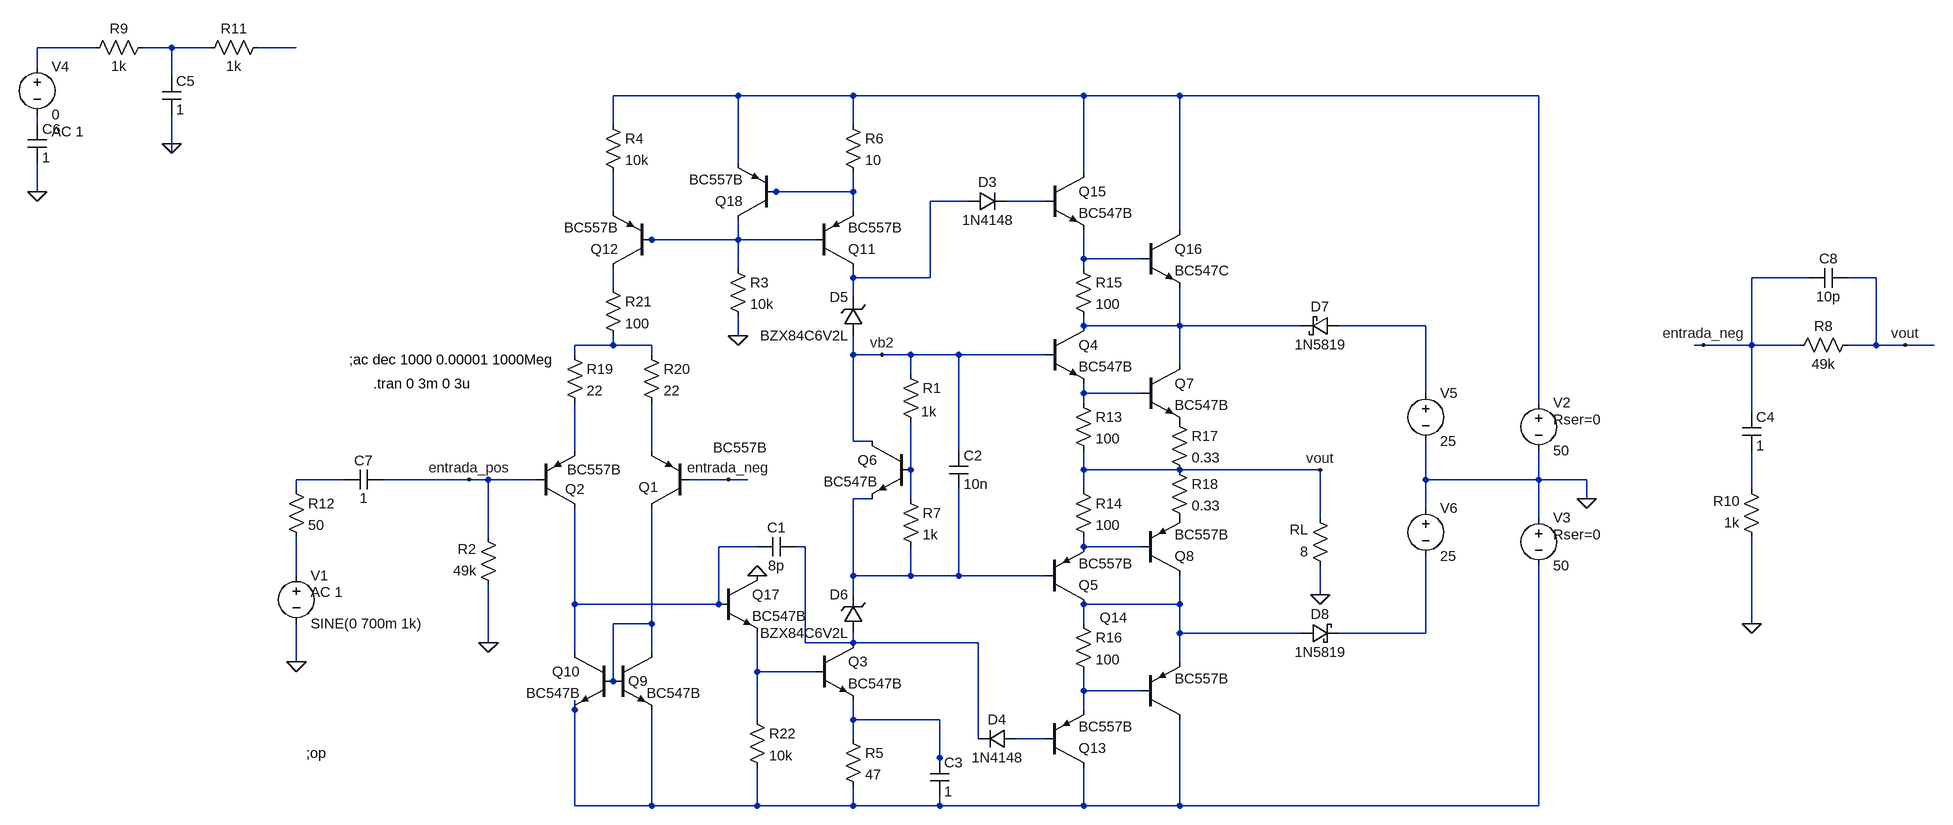
[diagram p0: schematic amplificador clase G.asc]
amplificador clase G.asc, the LTspice schematic file:
Version 4
SHEET 1 1332 756
WIRE -2064 -928 -2160 -928
WIRE -1936 -928 -1984 -928
WIRE -1872 -928 -1936 -928
WIRE -1728 -928 -1792 -928
WIRE -2160 -896 -2160 -928
WIRE -1936 -880 -1936 -928
WIRE -992 -848 -1200 -848
WIRE -800 -848 -992 -848
WIRE -416 -848 -800 -848
WIRE -256 -848 -416 -848
WIRE 496 -848 -256 -848
WIRE -2160 -800 -2160 -816
WIRE -1200 -800 -1200 -848
WIRE -800 -800 -800 -848
WIRE -1936 -768 -1936 -816
WIRE -1936 -752 -1936 -768
WIRE -992 -736 -992 -848
WIRE -416 -720 -416 -848
WIRE -2160 -688 -2160 -736
WIRE -928 -688 -944 -688
WIRE -800 -688 -800 -720
WIRE -800 -688 -928 -688
WIRE -608 -672 -672 -672
WIRE -480 -672 -544 -672
WIRE -1200 -656 -1200 -720
WIRE -800 -656 -800 -688
WIRE -256 -624 -256 -848
WIRE -1136 -608 -1152 -608
WIRE -992 -608 -992 -640
WIRE -992 -608 -1136 -608
WIRE -864 -608 -992 -608
WIRE -416 -576 -416 -624
WIRE -320 -576 -416 -576
WIRE -992 -560 -992 -608
WIRE -416 -560 -416 -576
WIRE -800 -544 -800 -560
WIRE -672 -544 -672 -672
WIRE -672 -544 -800 -544
WIRE 1120 -544 1024 -544
WIRE 1232 -544 1184 -544
WIRE -1200 -528 -1200 -560
WIRE -800 -512 -800 -544
WIRE -416 -464 -416 -480
WIRE -256 -464 -256 -528
WIRE -256 -464 -416 -464
WIRE -32 -464 -256 -464
WIRE 256 -464 32 -464
WIRE -992 -448 -992 -480
WIRE -1200 -432 -1200 -448
WIRE -1200 -432 -1264 -432
WIRE -1136 -432 -1200 -432
WIRE 944 -432 928 -432
WIRE 1024 -432 1024 -544
WIRE 1024 -432 944 -432
WIRE 1104 -432 1024 -432
WIRE 1232 -432 1232 -544
WIRE 1232 -432 1184 -432
WIRE 1280 -432 1232 -432
WIRE 1328 -432 1280 -432
WIRE -1264 -416 -1264 -432
WIRE -1136 -416 -1136 -432
WIRE -800 -416 -800 -448
WIRE -752 -416 -800 -416
WIRE -704 -416 -752 -416
WIRE -624 -416 -704 -416
WIRE -480 -416 -624 -416
WIRE -256 -400 -256 -464
WIRE -704 -384 -704 -416
WIRE -416 -352 -416 -368
WIRE -320 -352 -416 -352
WIRE 256 -352 256 -464
WIRE -416 -336 -416 -352
WIRE 496 -336 496 -848
WIRE 1024 -320 1024 -432
WIRE -800 -272 -800 -416
WIRE -768 -272 -800 -272
WIRE -1264 -256 -1264 -336
WIRE -1136 -256 -1136 -336
WIRE -624 -256 -624 -416
WIRE -704 -224 -704 -304
WIRE -416 -224 -416 -256
WIRE -256 -224 -416 -224
WIRE 0 -224 -256 -224
WIRE -1648 -208 -1728 -208
WIRE -1440 -208 -1584 -208
WIRE -1408 -208 -1440 -208
WIRE -1328 -208 -1408 -208
WIRE -1008 -208 -1072 -208
WIRE -976 -208 -1008 -208
WIRE 256 -208 256 -272
WIRE 496 -208 496 -256
WIRE 496 -208 256 -208
WIRE 576 -208 496 -208
WIRE -1728 -192 -1728 -208
WIRE -416 -192 -416 -224
WIRE 1024 -192 1024 -256
WIRE -768 -176 -800 -176
WIRE -704 -176 -704 -224
WIRE 576 -176 576 -208
WIRE 256 -160 256 -208
WIRE 0 -144 0 -224
WIRE 496 -144 496 -208
WIRE -1408 -112 -1408 -208
WIRE -960 -96 -1024 -96
WIRE -880 -96 -896 -96
WIRE -416 -96 -416 -112
WIRE -320 -96 -416 -96
WIRE -1728 -48 -1728 -112
WIRE -800 -48 -800 -176
WIRE -704 -48 -704 -96
WIRE -704 -48 -800 -48
WIRE -624 -48 -624 -192
WIRE -624 -48 -704 -48
WIRE -480 -48 -624 -48
WIRE -800 -16 -800 -48
WIRE 0 -16 0 -64
WIRE -1264 0 -1264 -160
WIRE -1024 0 -1024 -96
WIRE -1024 0 -1264 0
WIRE -256 0 -256 -48
WIRE -256 0 -416 0
WIRE -1136 32 -1136 -160
WIRE -1136 32 -1200 32
WIRE -416 32 -416 0
WIRE 1024 32 1024 -112
WIRE -256 48 -256 0
WIRE -32 48 -256 48
WIRE 256 48 256 -80
WIRE 256 48 32 48
WIRE -1408 64 -1408 -32
WIRE -880 64 -880 -96
WIRE -800 64 -800 48
WIRE -800 64 -880 64
WIRE -592 64 -800 64
WIRE -1264 80 -1264 0
WIRE -1136 80 -1136 32
WIRE -1728 96 -1728 32
WIRE -256 96 -256 48
WIRE -960 112 -960 48
WIRE -864 112 -960 112
WIRE -1200 128 -1200 32
WIRE -416 144 -416 112
WIRE -320 144 -416 144
WIRE -1264 176 -1264 160
WIRE -416 176 -416 144
WIRE -960 192 -960 112
WIRE -800 192 -800 160
WIRE -656 192 -800 192
WIRE -800 224 -800 192
WIRE -592 224 -592 64
WIRE -480 224 -528 224
WIRE -656 256 -656 192
WIRE -656 272 -656 256
WIRE -1264 336 -1264 176
WIRE -1136 336 -1136 176
WIRE -1136 336 -1264 336
WIRE -960 336 -960 272
WIRE -960 336 -1136 336
WIRE -800 336 -800 304
WIRE -800 336 -960 336
WIRE -656 336 -656 320
WIRE -656 336 -800 336
WIRE -416 336 -416 272
WIRE -416 336 -656 336
WIRE -256 336 -256 192
WIRE -256 336 -416 336
WIRE 496 336 496 -64
WIRE 496 336 -256 336
FLAG 576 -176 0
FLAG -1408 64 0
FLAG 0 -16 0
FLAG 0 -224 vout
FLAG -752 -416 vb2
FLAG -1936 -768 0
FLAG -2160 -688 0
FLAG -1728 96 0
FLAG 1024 32 0
FLAG 944 -432 entrada_neg
FLAG -1008 -208 entrada_neg
FLAG 1280 -432 vout
FLAG -1440 -208 entrada_pos
FLAG -992 -448 0
FLAG -960 -48 0
SYMBOL res -1216 -816 R0
SYMATTR InstName R4
SYMATTR Value 10k
SYMBOL res -1392 -16 R180
WINDOW 0 36 76 Left 2
WINDOW 3 36 40 Left 2
SYMATTR InstName R2
SYMATTR Value 49k
SYMBOL res -816 208 R0
SYMATTR InstName R5
SYMATTR Value 47
SYMBOL res -816 -816 R0
SYMATTR InstName R6
SYMATTR Value 10
SYMBOL res 1200 -448 R90
WINDOW 0 0 56 VBottom 2
WINDOW 3 32 56 VTop 2
SYMATTR InstName R8
SYMATTR Value 49k
SYMBOL res 1040 -96 R180
WINDOW 0 36 76 Left 2
WINDOW 3 36 40 Left 2
SYMATTR InstName R10
SYMATTR Value 1k
SYMBOL res 16 -48 R180
WINDOW 0 36 76 Left 2
WINDOW 3 36 40 Left 2
SYMATTR InstName RL
SYMATTR Value 8
SYMBOL voltage 496 -352 R0
WINDOW 123 0 0 Left 2
WINDOW 39 24 44 Left 2
SYMATTR SpiceLine Rser=0
SYMATTR InstName V2
SYMATTR Value 50
SYMBOL voltage 496 -160 R0
WINDOW 123 0 0 Left 2
WINDOW 39 24 44 Left 2
SYMATTR SpiceLine Rser=0
SYMATTR InstName V3
SYMATTR Value 50
SYMBOL pnp -1072 -160 R180
WINDOW 0 53 35 Left 2
WINDOW 3 -128 101 Left 2
SYMATTR InstName Q1
SYMATTR Value BC557B
SYMBOL pnp -1328 -160 M180
WINDOW 0 48 32 Left 2
WINDOW 3 51 64 Left 2
SYMATTR InstName Q2
SYMATTR Value BC557B
SYMBOL npn -864 64 R0
SYMATTR InstName Q3
SYMATTR Value BC547B
SYMBOL npn -480 -464 R0
SYMATTR InstName Q4
SYMATTR Value BC547B
SYMBOL cap 1008 -320 R0
SYMATTR InstName C4
SYMATTR Value 1
SYMBOL cap -672 256 R0
SYMATTR InstName C3
SYMATTR Value 1
SYMBOL pnp -480 0 M180
SYMATTR InstName Q5
SYMATTR Value BC557B
SYMBOL npn -704 -272 M0
SYMATTR InstName Q6
SYMATTR Value BC547B
SYMBOL res -720 -400 R0
WINDOW 3 33 79 Left 2
SYMATTR Value 1k
SYMATTR InstName R1
SYMBOL res -720 -192 R0
SYMATTR InstName R7
SYMATTR Value 1k
SYMBOL cap -640 -256 R0
SYMATTR InstName C2
SYMATTR Value 10n
SYMBOL res -1968 -944 R90
WINDOW 0 0 56 VBottom 2
WINDOW 3 32 56 VTop 2
SYMATTR InstName R9
SYMATTR Value 1k
SYMBOL res -1776 -944 R90
WINDOW 0 0 56 VBottom 2
WINDOW 3 32 56 VTop 2
SYMATTR InstName R11
SYMATTR Value 1k
SYMBOL cap -1952 -880 R0
SYMATTR InstName C5
SYMATTR Value 1
SYMBOL cap -2176 -800 R0
SYMATTR InstName C6
SYMATTR Value 1
SYMBOL voltage -2160 -912 R0
WINDOW 123 24 124 Left 2
WINDOW 39 0 0 Left 2
SYMATTR Value2 AC 1
SYMATTR InstName V4
SYMATTR Value 0
SYMBOL voltage -1728 -64 R0
WINDOW 123 24 44 Left 2
WINDOW 39 0 0 Left 2
SYMATTR Value2 AC 1
SYMATTR InstName V1
SYMATTR Value SINE(0 700m 1k)
SYMBOL res -1744 -208 R0
SYMATTR InstName R12
SYMATTR Value 50
SYMBOL cap -1584 -224 R90
WINDOW 0 0 32 VBottom 2
WINDOW 3 32 32 VTop 2
SYMATTR InstName C7
SYMATTR Value 1
SYMBOL npn -320 -400 R0
SYMATTR InstName Q7
SYMATTR Value BC547B
SYMBOL pnp -320 -48 M180
SYMATTR InstName Q8
SYMATTR Value BC557B
SYMBOL res -432 -352 R0
SYMATTR InstName R13
SYMATTR Value 100
SYMBOL res -432 -208 R0
SYMATTR InstName R14
SYMATTR Value 100
SYMBOL npn -1200 80 R0
WINDOW 0 25 48 Left 2
SYMATTR InstName Q9
SYMATTR Value BC547B
SYMBOL npn -1200 80 M0
SYMATTR InstName Q10
SYMATTR Value BC547B
SYMBOL pnp -864 -560 M180
SYMATTR InstName Q11
SYMATTR Value BC557B
SYMBOL pnp -1136 -560 R180
SYMATTR InstName Q12
SYMATTR Value BC557B
SYMBOL pnp -480 272 M180
SYMATTR InstName Q13
SYMATTR Value BC557B
SYMBOL pnp -320 192 M180
WINDOW 0 -69 170 Left 2
SYMATTR InstName Q14
SYMATTR Value BC557B
SYMBOL npn -480 -720 R0
SYMATTR InstName Q15
SYMATTR Value BC547B
SYMBOL npn -320 -624 R0
SYMATTR InstName Q16
SYMATTR Value BC547C
SYMBOL res -432 -576 R0
SYMATTR InstName R15
SYMATTR Value 100
SYMBOL res -432 16 R0
SYMATTR InstName R16
SYMATTR Value 100
SYMBOL diode -608 -656 R270
WINDOW 0 32 32 VTop 2
WINDOW 3 0 32 VBottom 2
SYMATTR InstName D3
SYMATTR Value 1N4148
SYMBOL diode -528 208 R90
WINDOW 0 0 32 VBottom 2
WINDOW 3 32 32 VTop 2
SYMATTR InstName D4
SYMATTR Value 1N4148
SYMBOL zener -784 -448 R180
WINDOW 0 24 64 Left 2
WINDOW 3 24 0 Left 2
SYMATTR InstName D5
SYMATTR Value BZX84C6V2L
SYMBOL zener -784 48 R180
WINDOW 0 24 64 Left 2
WINDOW 3 24 0 Left 2
SYMATTR InstName D6
SYMATTR Value BZX84C6V2L
SYMBOL schottky 32 -480 R90
WINDOW 0 0 32 VBottom 2
WINDOW 3 32 32 VTop 2
SYMATTR InstName D7
SYMATTR Value 1N5819
SYMBOL schottky -32 64 R270
WINDOW 0 32 32 VTop 2
WINDOW 3 0 32 VBottom 2
SYMATTR InstName D8
SYMATTR Value 1N5819
SYMBOL voltage 256 -368 R0
SYMATTR InstName V5
SYMATTR Value 25
SYMBOL voltage 256 -176 R0
SYMATTR InstName V6
SYMATTR Value 25
SYMBOL npn -1024 -48 R0
SYMATTR InstName Q17
SYMATTR Value BC547B
SYMBOL pnp -928 -640 R180
SYMATTR InstName Q18
SYMATTR Value BC557B
SYMBOL res -1008 -576 R0
SYMATTR InstName R3
SYMATTR Value 10k
SYMBOL res -272 -320 R0
SYMATTR InstName R17
SYMATTR Value 0.33
SYMBOL res -272 -240 R0
SYMATTR InstName R18
SYMATTR Value 0.33
SYMBOL res -1280 -432 R0
SYMATTR InstName R19
SYMATTR Value 22
SYMBOL res -1152 -432 R0
SYMATTR InstName R20
SYMATTR Value 22
SYMBOL res -1216 -544 R0
SYMATTR InstName R21
SYMATTR Value 100
SYMBOL cap -896 -112 R90
WINDOW 0 0 32 VBottom 2
WINDOW 3 32 32 VTop 2
SYMATTR InstName C1
SYMATTR Value 8p
SYMBOL res -976 176 R0
SYMATTR InstName R22
SYMATTR Value 10k
SYMBOL cap 1184 -560 R90
WINDOW 0 0 32 VBottom 2
WINDOW 3 32 32 VTop 2
SYMATTR InstName C8
SYMATTR Value 10p
TEXT -1712 248 Left 2 !;op
TEXT -1600 -368 Left 2 !.tran 0 3m 0 3u
TEXT -1640 -408 Left 2 !;ac dec 1000 0.00001 1000Meg

The netlist it stands for:
* amplificador clase G.asc
R4 N004 N009 10k
R2 0 entrada_pos 49k
R5 N033 N032 47
R6 N004 N006 10
R8 vout entrada_neg 49k
R10 0 N021 1k
RL 0 vout 8
V2 N004 0 50 Rser=0
V3 0 N032 50 Rser=0
Q1 N028 entrada_neg N018 0 BC557B
Q2 N023 entrada_pos N017 0 BC557B
Q3 N024 N030 N033 0 BC547B
Q4 N013 vb2 N016 0 BC547B
C4 entrada_neg N021 1
C3 N033 N032 1
Q5 N027 N022 N025 0 BC557B
Q6 vb2 N019 N022 0 BC547B
R1 vb2 N019 1k
R7 N019 N022 1k
C2 vb2 N022 10n
R9 N002 N001 1k
R11 N003 N002 1k
C5 N002 0 1
C6 N005 0 1
V4 N001 N005 0 AC 1
V1 N026 0 SINE(0 700m 1k) AC 1
R12 N020 N026 50
C7 entrada_pos N020 1
Q7 N013 N016 P001 0 BC547B
Q8 N027 N025 P002 0 BC557B
R13 N016 vout 100
R14 vout N025 100
Q9 N028 N028 N032 0 BC547B
Q10 N023 N028 N032 0 BC547B
Q11 N007 N010 N006 0 BC557B
Q12 N012 N010 N009 0 BC557B
Q13 N032 N034 N031 0 BC557B
Q14 N032 N031 N027 0 BC557B
Q15 N004 N008 N011 0 BC547B
Q16 N004 N011 N013 0 BC547C
R15 N011 N013 100
R16 N027 N031 100
D3 N007 N008 1N4148
D4 N034 N024 1N4148
D5 vb2 N007 BZX84C6V2L
D6 N024 N022 BZX84C6V2L
D7 N014 N013 1N5819
D8 N027 N029 1N5819
V5 N014 0 25
V6 0 N029 25
Q17 0 N023 N030 0 BC547B
Q18 N010 N006 N004 0 BC557B
R3 N010 0 10k
R17 P001 vout 0.33
R18 vout P002 0.33
R19 N015 N017 22
R20 N015 N018 22
R21 N012 N015 100
C1 N024 N023 8p
R22 N030 N032 10k
C8 vout entrada_neg 10p
.model D D
.lib standard.dio
.model NPN NPN
.model PNP PNP
.lib standard.bjt
;op
.tran 0 3m 0 3u
;ac dec 1000 0.00001 1000Meg
.backanno
.end